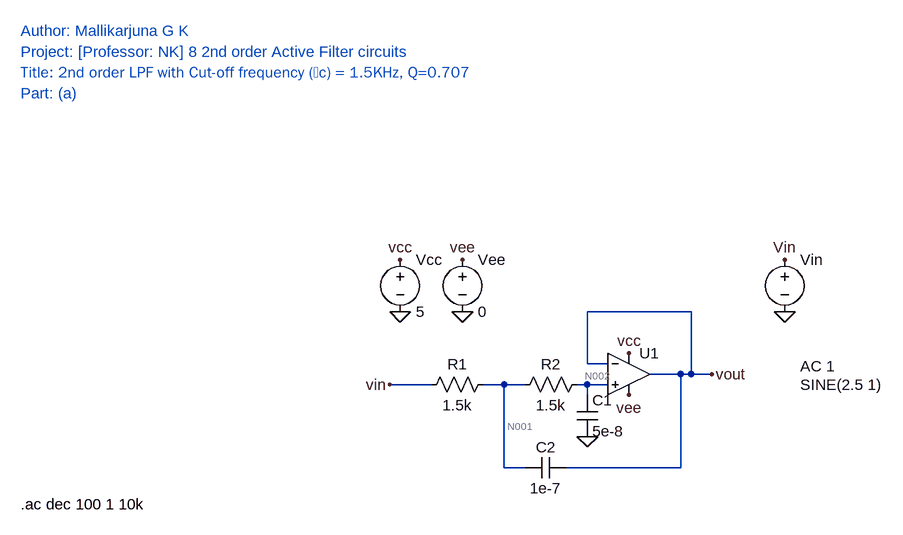
[diagram p0: schematic lpf.asc]
lpf.asc, the LTspice schematic file:
Version 4
SHEET 1 880 680
WIRE 384 128 224 128
WIRE 224 208 224 128
WIRE 256 208 224 208
WIRE 368 224 320 224
WIRE 384 224 384 128
WIRE 384 224 368 224
WIRE 416 224 384 224
WIRE -16 240 -80 240
WIRE 96 240 64 240
WIRE 128 240 96 240
WIRE 224 240 208 240
WIRE 256 240 224 240
WIRE 224 256 224 240
WIRE 96 368 96 240
WIRE 128 368 96 368
WIRE 368 368 368 224
WIRE 368 368 192 368
FLAG -64 128 0
FLAG 32 128 0
FLAG -64 48 vcc
FLAG 32 48 vee
FLAG 288 192 vcc
FLAG 288 256 vee
FLAG 224 320 0
FLAG 528 128 0
FLAG 528 48 Vin
FLAG 416 224 vout
FLAG -80 240 vin
SYMBOL voltage -64 32 R0
WINDOW 123 0 0 Left 0
WINDOW 39 0 0 Left 0
SYMATTR InstName Vcc
SYMATTR Value 5
SYMBOL voltage 32 32 R0
WINDOW 123 0 0 Left 0
WINDOW 39 0 0 Left 0
SYMATTR InstName Vee
SYMATTR Value 0
SYMBOL OpAmps\\UniversalOpAmp2 288 224 R0
SYMATTR InstName U1
SYMBOL res 80 224 R90
WINDOW 0 0 56 VBottom 2
WINDOW 3 32 56 VTop 2
SYMATTR InstName R1
SYMATTR Value 1.5k
SYMBOL res 224 224 R90
WINDOW 0 0 56 VBottom 2
WINDOW 3 32 56 VTop 2
SYMATTR InstName R2
SYMATTR Value 1.5k
SYMBOL cap 208 256 R0
SYMATTR InstName C1
SYMATTR Value 5e-8
SYMBOL cap 192 352 R90
WINDOW 0 0 32 VBottom 2
WINDOW 3 32 32 VTop 2
SYMATTR InstName C2
SYMATTR Value 1e-7
SYMBOL voltage 528 32 R0
WINDOW 3 24 208 Left 2
WINDOW 123 24 180 Left 2
WINDOW 39 0 0 Left 0
SYMATTR Value SINE(2.5 1)
SYMATTR Value2 AC 1
SYMATTR InstName Vin
TEXT -648 -304 Left 2 ;Author: Mallikarjuna G K
TEXT -648 -272 Left 2 ;Project: [Professor: NK] 8 2nd order Active Filter circuits
TEXT -648 -240 Left 2 ;Title: 2nd order LPF with Cut-off frequency (c) = 1.5KHz, Q=0.707
TEXT -648 -208 Left 2 ;Part: (a)
TEXT -648 424 Left 2 !.ac dec 100 1 10k

The netlist it stands for:
* lpf.asc
Vcc vcc 0 5
Vee vee 0 0
XU1 N002 vout vcc vee vout level2 Avol=1Meg GBW=10Meg Slew=10Meg Ilimit=25m Rail=0 Vos=0 En=0 Enk=0 In=0 Ink=0 Rin=500Meg  ; pins In+ In- V+ V- OUT
R1 N001 Vin 1.5k
R2 N002 N001 1.5k
C1 N002 0 5e-8
C2 vout N001 1e-7
Vin Vin 0 SINE(2.5 1) AC 1
* Author: Mallikarjuna G K
* Project: [Professor: NK] 8 2nd order Active Filter circuits
* Title: 2nd order LPF with Cut-off frequency (c) = 1.5KHz, Q=0.707
* Part: (a)
.ac dec 100 1 10k
.lib UniversalOpAmp2.lib
.backanno
.end

* Results of the author's LTspice run, read from the files saved beside the schematic
* Operating Point, zero values left out:
*   V(vcc) = 5 V
*   V(vout) = 2.5 V
*   V(n002) = 2.5 V
*   V(n001) = 2.5 V
*   V(vin) = 2.5 V
*   I(Vcc) = -250 µA
*   I(Vee) = 250 µA
*   Ix(u1:3) = 250 µA
*   Ix(u1:4) = -250 µA
*   Ix(u1:5) = 198.3 pA
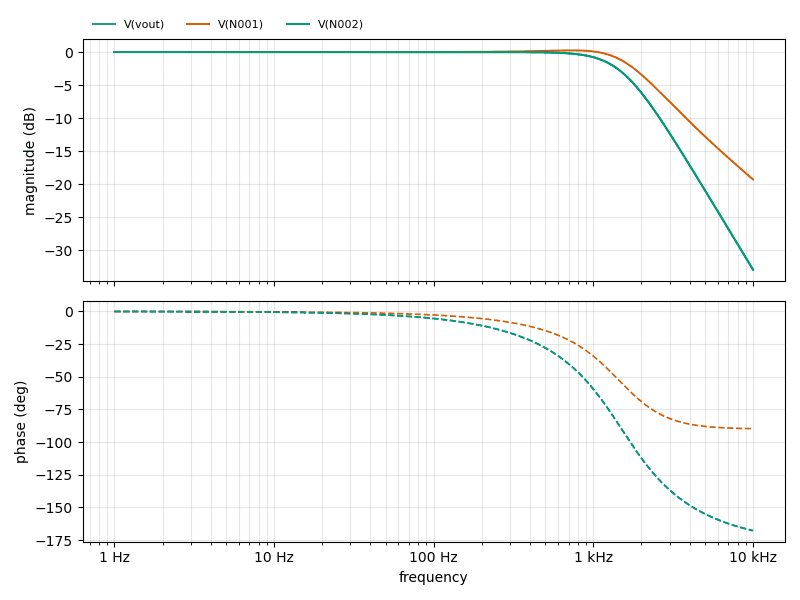
[diagram p1: AC Analysis of lpf.asc, plotted from the saved traces]
* AC Analysis, 1 run:
*   V(vout): -0.00 dB at 1 Hz, -32.96 dB at 10 kHz, peak -0.00 dB at 21.88 Hz, 3 dB below the peak at 1.5 kHz
*   V(N001): -0.00 dB at 1 Hz, -19.30 dB at 10 kHz, peak 0.25 dB at 724.4 Hz, 3 dB below the peak at 1.854 kHz
*   V(N002): -0.00 dB at 1 Hz, -32.96 dB at 10 kHz, peak -0.00 dB at 21.88 Hz, 3 dB below the peak at 1.5 kHz